# EasyEDA Pro project 学期项目.epro, board PCB1
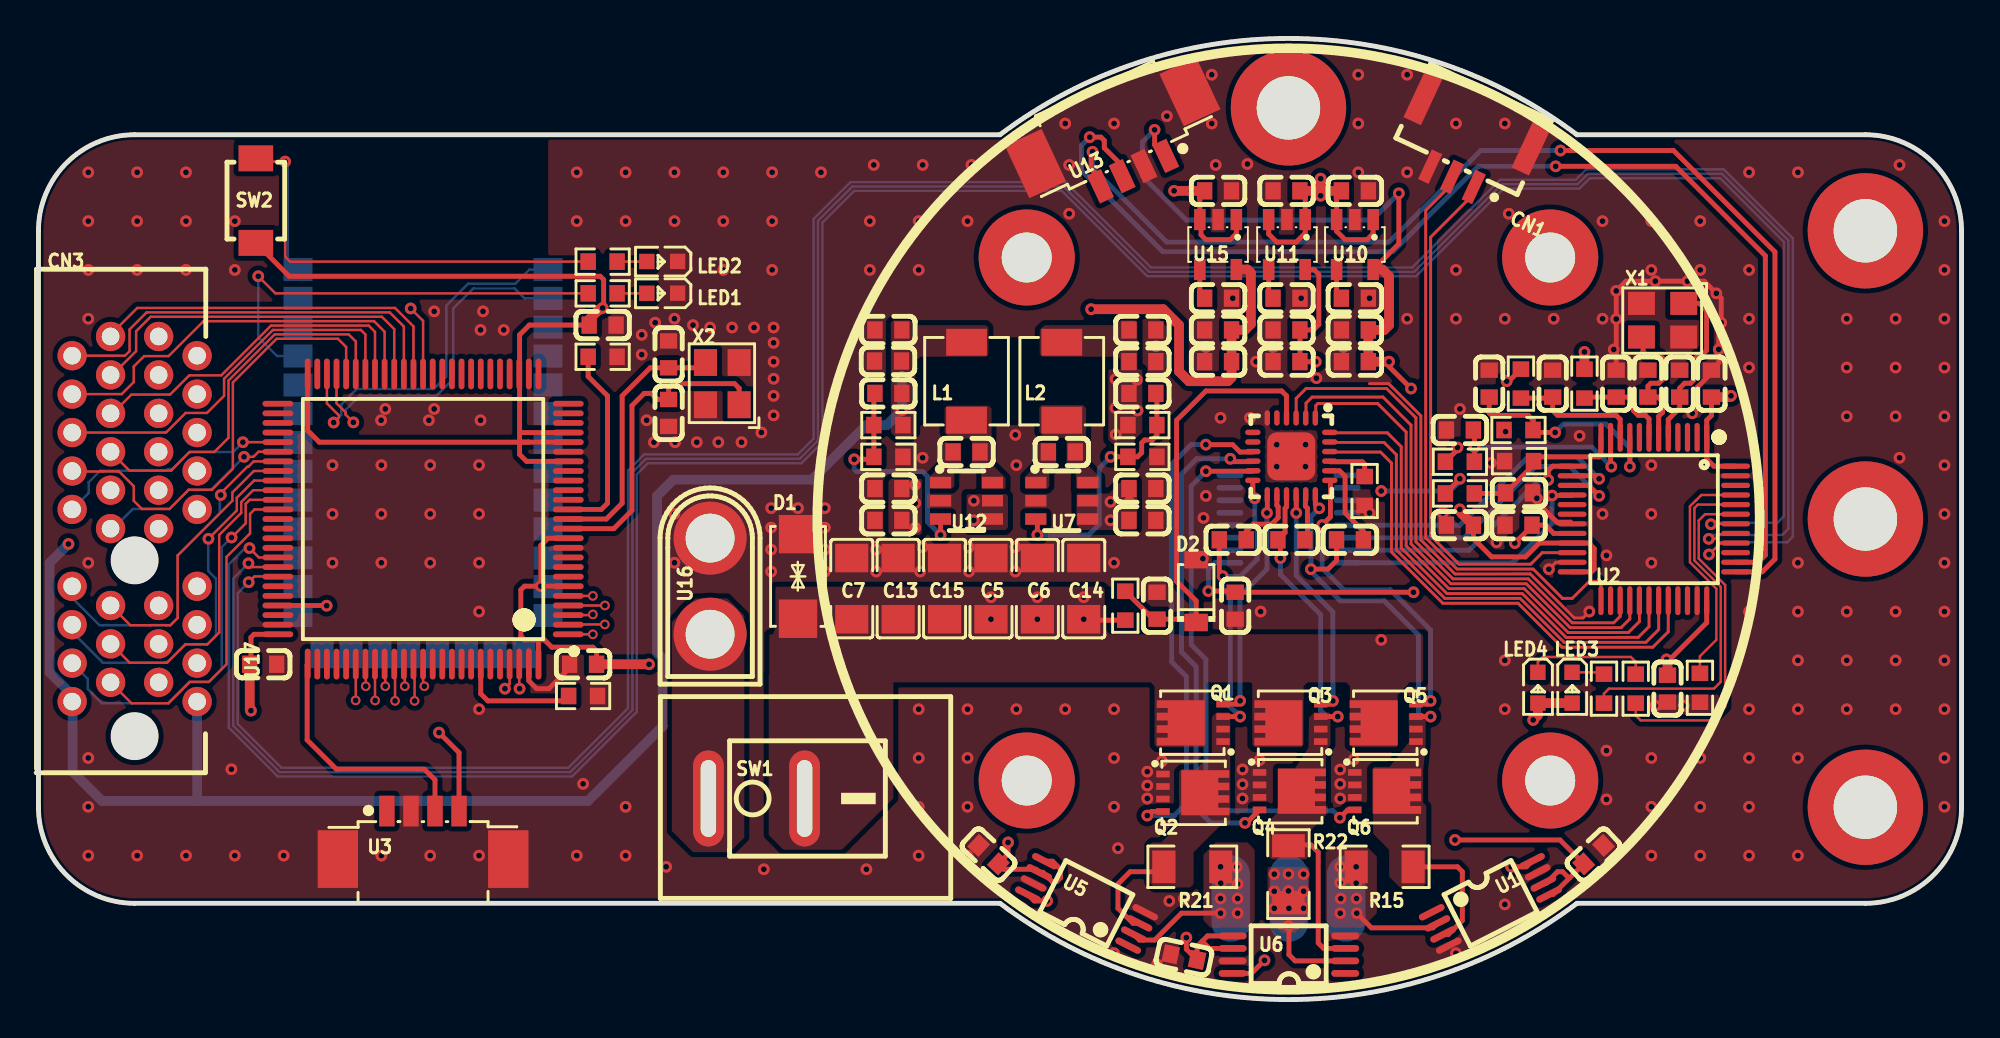
[diagram p11: board, top side]
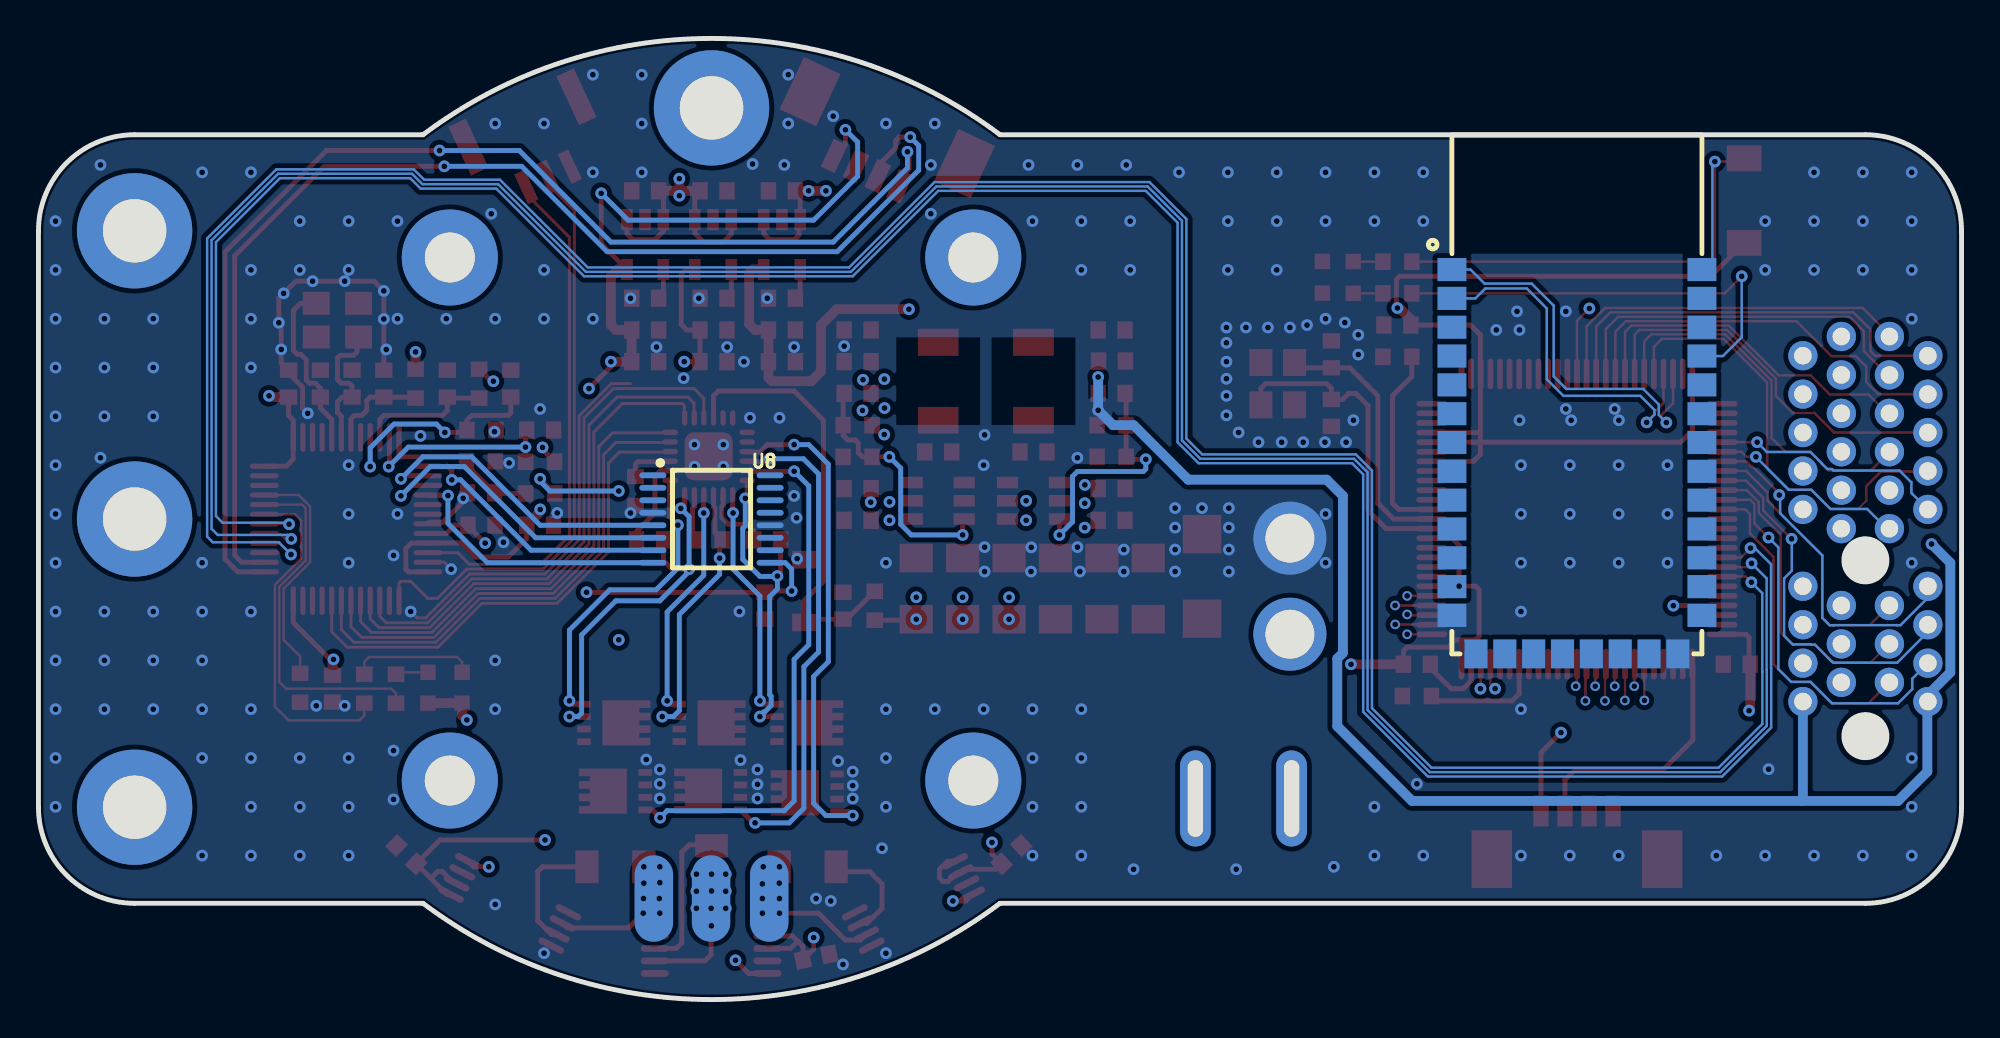
[diagram p12: board, bottom side, seen from below]

Outline 100 x 50.02 mm; copper layers: Top Layer, 地层, 电源层, Bottom Layer. Coordinates in mm from the lower left corner of the outline.
Outline path: 0,40.01 arc(1.46,43.54) 5,45.01 50,45.01 arc(65,50.02) 80,45.01 95,45.01 arc(98.54,43.54) 100,40.01 100,10.01 arc(98.54,6.47) 95,5.01 80,5.01 arc(65,0) 50,5.01 5,5.01 arc(1.46,6.47) 0,10.01 0,40.01
Stack: Top Layer 0.035mm Outer layer thickness 1oz / Dielectric1 0.2104mm 7628 RC49% 8.6mil / 地层 0.0152mm Inner layer thickness / Dielectric2 1.065mm 1.1mm H/HOZ Copper / 电源层 0.0152mm Inner layer thickness / Dielectric3 0.2104mm 7628 RC49% 8.6mil / Bottom Layer 0.035mm Outer layer thickness 1oz

## Design rules (mm)
spacing copperThickness1oz (default): track to track 0.102, other pairs 0.152 to 0.3
spacing copperThickness2oz: track to track 0.203, other pairs 0.152 to 0.3
spacing safeClearance1: track to track 0.152, other pairs 0.152 to 0.3
track width copperThickness1oz (default): min 0.127, default 0.254, max 2.54
track width copperThickness2oz: min 0.203, default 0.254, max 2.54
differential pair differentialPair (default): width min 0.127, default 0.254, max 2.54; gap min 0.152, default 0.152
net GND uses copperRegion

## Placement (name value [footprint] x y rotation side)
C1  10uF  [C0603]  58.17 20.5 270 top
C2  100nF  [C0603]  49.4 7.54 317 top
C3  100nF  [C0603]  80.87 7.54 223 top
C4  1uF  [C0603]  62.1 23.93 180 top
C5  47uF  [C1206]  49.53 21.39 270 top
C6  47uF  [C1206]  51.94 21.39 270 top
C7  47uF  [C1206]  42.29 21.39 270 top
C8  100nF  [C0603]  64.9 34.85 0 top
C9  100nF  [C0603]  64.9 33.2 0 top
C10  100nF  [C0603]  82.04 32.06 270 top
C11  10uF  [C0603]  57.4 34.85 180 top
C12  100nF  [C0603]  11.69 17.45 180 top
C13  47uF  [C1206]  44.7 21.39 270 top
C14  47uF  [C1206]  54.36 21.39 270 top
C15  47uF  [C1206]  47.12 21.39 270 top
C16  100nF  [C0603]  59.56 2.21 348 top
C17  100nF  [C0603]  68.45 33.2 0 top
C18  100nF  [C0603]  68.45 34.85 0 top
C19  100nF  [C0603]  68.45 36.5 180 top
C20  100nF  [C0603]  62.23 20.5 270 top
C21  100nF  [C0603]  76.99 26.37 180 top
C22  100nF  [C0603]  44.18 33.23 0 top
C23  100nF  [C0603]  73.91 29.64 0 top
C24  100nF  [C0603]  78.74 32.06 90 top
C25  100nF  [C0603]  64.9 36.5 180 top
C26  100nF  [C0603]  48.26 28.5 180 top
C27  22uF  [C0603]  57.4 24.94 180 top
C28  100nF  [C0603]  87 32.06 90 top
C29  100nF  [C0603]  84.71 16.18 270 top
C30  100nF  [C0603]  73.91 24.69 180 top
C31  16pF  [C0603]  83.69 32.06 270 top
C32  16pF  [C0603]  85.34 32.06 90 top
C33  100nF  [C0603]  57.4 33.2 180 top
C34  100nF  [C0603]  53.21 28.5 180 top
C35  100pF  [C0603]  57.4 31.55 180 top
C36  100nF  [C0603]  57.4 26.59 180 top
C37  1uF  [C0603]  68.45 42.09 180 top
C38  1uF  [C0603]  64.9 42.09 0 top
C39  100nF  [C0603]  76.96 24.69 0 top
C40  100nF  [C0603]  28.32 17.45 0 top
C41  100nF  [C0603]  75.44 32.06 90 top
C42  1uF  [C0603]  65.15 23.93 180 top
C43  1uF  [C0603]  68.2 23.93 180 top
C44  100pF  [C0603]  44.2 31.55 0 top
C45  100nF  [C0603]  44.2 24.94 0 top
C46  10uF  [C0603]  44.2 34.85 0 top
C47  100nF  [C0603]  29.34 35.1 180 top
C48  22uF  [C0603]  44.2 26.59 0 top
C49  16pF  [C0603]  32.77 33.58 270 top
C50  16pF  [C0603]  32.77 30.53 270 top
C51  100nF  [C0603]  61.34 33.2 0 top
C52  100nF  [C0603]  61.34 34.85 0 top
C53  100nF  [C0603]  61.34 36.5 180 top
C54  1uF  [C0603]  61.34 42.09 180 top
CN1  WAFER-GH1.25-3PWB  [CONN-TH_3P-P1.25_GH1.25]  74.17 44.25 155 top
CN3  3183-10110P1T  [CONN-TH_36P-P1.00-V_3183-XXXXXPXT]  5 25.01 270 top
D1  SMAJ40CA  [SMA_L4.3-W2.6-LS5.0-BI]  39.5 22.02 270 top
D2  MM1Z20  [SOD-123_L2.7-W1.6-LS3.7-RD]  60.2 21.26 90 top
L1  10uH  [IND-SMD_L4.4-W4.2]  48.26 32.18 270 top
L2  10uH  [IND-SMD_L4.4-W4.2]  53.21 32.18 270 top
LED1  -  [LED_0603]  32.38 36.75 180 top
LED2  -  [LED_0603]  32.38 38.41 180 top
LED3  -  [LED_0603]  79.76 16.18 270 top
LED4  -  [LED_0603]  77.98 16.18 270 top
NOREF  -  [Pad_e466]  51.39 11.4 0 top
NOREF#2  -  [Pad_e451]  95 40.01 0 top
NOREF#3  -  [Pad_e452]  95 25.01 0 top
NOREF#4  -  [Pad_e467]  78.61 11.4 0 top
NOREF#5  -  [Pad_e495]  65 46.41 0 top
NOREF#6  -  [Pad_e544]  68 5.26 0 top
NOREF#7  -  [Pad_e468]  78.61 38.62 0 top
NOREF#8  -  [Pad_e542]  62 5.26 0 top
NOREF#9  -  [Pad_e543]  65.02 5.26 0 top
NOREF#10  -  [Pad_e469]  51.39 38.62 0 top
NOREF#11  -  [Pad_e453]  95 10.01 0 top
Q1  AON7544  [DFN-8_L3.3-W3.3-P0.65-BL-2]  60.83 14.4 90 top
Q2  AON7544  [DFN-8_L3.3-W3.3-P0.65-BL-2]  59.24 10.76 270 top
Q3  AON7544  [DFN-8_L3.3-W3.3-P0.65-BL-2]  65.91 14.4 90 top
Q4  AON7544  [DFN-8_L3.3-W3.3-P0.65-BL-2]  64.26 10.85 270 top
Q5  AON7544  [DFN-8_L3.3-W3.3-P0.65-BL-2]  70.87 14.4 90 top
Q6  AON7544  [DFN-8_L3.3-W3.3-P0.65-BL-2]  69.22 10.85 270 top
R1  10K  [R0603]  80.39 32.06 90 top
R2  43K  [R0603]  44.2 29.9 0 top
R3  40K  [R0603]  68.96 26.47 270 top
R4  100R  [R0603]  77.09 32.06 90 top
R5  510  [R0603]  56.51 20.5 270 top
R6  10K  [R0603]  81.41 16.18 270 top
R7  10K  [R0603]  83.06 16.18 270 top
R8  75K  [R0603]  73.91 26.34 180 top
R9  10K  [R0603]  76.99 28.02 0 top
R10  10K  [R0603]  44.2 28.25 180 top
R12  10K  [R0603]  86.4 16.23 270 top
R13  100R  [R0603]  73.91 27.99 180 top
R14  100R  [R0603]  76.96 29.64 180 top
R15  20mΩ  [R1206]  70 6.91 180 top
R16  22K  [R0603]  57.4 29.9 180 top
R17  10K  [R0603]  28.32 15.8 0 top
R18  3K  [R0603]  57.4 28.25 180 top
R19  10K  [R0603]  29.34 33.45 0 top
R20  10K  [R0603]  29.34 36.75 180 top
R21  20mΩ  [R1206]  60 6.91 0 top
R22  20mΩ  [R1206]  65 6.53 270 top
R23  10K  [R0603]  29.34 38.41 180 top
SW1  HX KCD11-2P-R  [SW-TH_2P-L15.0-W10.5-P5.00_KCD11-2P-R]  37.34 10.47 0 top
SW2  K2-1807SN-A4DW-06  [SW-SMD_L4.0-W2.9-LS4.8-1]  11.3 41.58 270 top
U1  INA240A2QPWRQ1  [TSSOP-8_L4.4-W3.0-P0.65-LS6.4-BL]  75.5 5 297 top
U2  STM32G431CBT6  [LQFP-48_L7.0-W7.0-P0.50-LS9.0-BL]  84 25.01 180 top
U3  ZX-MX1.25-4PWT  [CONN-SMD_4P-P1.25-MX1.25-4P-WT]  20 8.56 0 top
U4  DRV8300D  [QFN24_L4.0_W4.0_P0.5]  65.15 28.27 180 top
U5  INA240A2QPWRQ1  [TSSOP-8_L4.4-W3.0-P0.65-LS6.4-BL]  54.5 5 63 top
U6  INA240A2QPWRQ1  [TSSOP-8_L4.4-W3.0-P0.65-LS6.4-BL]  65.02 2.34 90 top
U7  ME3121AM6G  [SOT-23-6_L2.9-W1.6-P0.95-LS2.8-BR]  53.21 25.96 180 top
U8  MT6826S  [TSSOP16_L5.0_W4.4_P0.65]  65 25.01 180 bottom
U10  RS3236-3.3AYF5  [SOT-23-5_L3.0-W1.7-P0.95-LS2.8-BR]  68.45 39.29 90 top
U11  RS3236-3.3AYF5  [SOT-23-5_L3.0-W1.7-P0.95-LS2.8-BR]  64.92 39.29 90 top
U12  ME3121AM6G  [SOT-23-6_L2.9-W1.6-P0.95-LS2.8-BR]  48.26 25.96 180 top
U13  ZX-MX1.25-4PWT  [CONN-SMD_4P-P1.25-MX1.25-4P-WT]  56.39 44.25 205 top
U14  HC05  [BULETM-SMD_HC-05]  20 27.99 180 bottom
U15  RS3236-3.3AYF5  [SOT-23-5_L3.0-W1.7-P0.95-LS2.8-BR]  61.34 39.29 90 top
U16  XT30U-M.G.B  [CONN-TH_XT30U-M]  34.93 21.51 90 top
U17  STM32F407VET6  [LQFP-100_L14.0-W14.0-P0.50-LS16.0-BL]  20 25.01 90 top
X1  16MHz  [OSC-SMD_4P-L3.2-W2.5-BL]  84.46 35.36 180 top
X2  16MHz  [OSC-SMD_4P-L3.2-W2.5-BL]  35.56 32.06 90 top

## Footprints (pads in the part's own frame, mm; a bottom-side part is the same pattern mirrored in y, then rotated)
BULETM-SMD_HC-05
  rect 1.5x1.2 smd: 1(-6.5,10) 2(-6.5,8.5) 3(-6.5,7) 4(-6.5,5.5) 5(-6.5,4) 6(-6.5,2.5) 7(-6.5,1) 8(-6.5,-0.5) 9(-6.5,-2) 10(-6.5,-3.5) 11(-6.5,-5) 12(-6.5,-6.5) 13(-6.5,-8) 22(6.5,-8) 23(6.5,-6.5) 24(6.5,-5) 25(6.5,-3.5) 26(6.5,-2) 27(6.5,-0.5) 28(6.5,1) 29(6.5,2.5) 30(6.5,4) 31(6.5,5.5) 32(6.5,7) 33(6.5,8.5) 34(6.5,10)
  rect 1.2x1.5 smd: 14(-5.25,-10) 15(-3.75,-10) 16(-2.25,-10) 17(-0.75,-10) 18(0.75,-10) 19(2.25,-10) 20(3.75,-10) 21(5.25,-10)
C0603
  rect 0.8x0.9 smd: 1(-0.7,0) 2(0.7,0)
C1206
  rect 1.485x1.728 smd: 1(-1.593,0) 2(1.593,0)
CONN-SMD_4P-P1.25-MX1.25-4P-WT
  rect 0.8x1.6 smd: 1(-1.88,1.25) 2(-0.63,1.25) 3(0.62,1.25) 4(1.87,1.25)
  rect 2.1x3 smd: 5(4.43,-1.25) 6(-4.43,-1.25)
CONN-TH_3P-P1.25_GH1.25
  rect 0.6x1.7 smd: 1(-1.25,1.575) 2(0,1.575) 3(1.25,1.575)
  rect 1x2.8 smd: 4(3.1,-1.575) 5(-3.1,-1.575)
CONN-TH_36P-P1.00-V_3183-XXXXXPXT
  round 1.524 hole 0.914: A1(-9.5,1.25) A2(-8.5,3.25) A3(-7.5,1.25) A4(-6.5,3.25) A5(-5.5,1.25) A6(-4.5,3.25) A7(-3.5,1.25) A8(-2.5,3.25) A9(-1.5,1.25) A10(-0.5,3.25) A11(0.5,1.25) A12(3.5,3.25) A13(4.5,1.25) A14(5.5,3.25) A15(6.5,1.25) A16(7.5,3.25) A17(8.5,1.25) A18(9.5,3.25) B1(-9.5,-1.25) B2(-8.5,-3.25) B3(-7.5,-1.25) B4(-6.5,-3.25) B5(-5.5,-1.25) B6(-4.5,-3.25) B7(-3.5,-1.25) B8(-2.5,-3.25) B9(-1.5,-1.25) B10(-0.5,-3.25) B11(0.5,-1.25) B12(3.5,-3.25) B13(4.5,-1.25) B14(5.5,-3.25) B15(6.5,-1.25) B16(7.5,-3.25) B17(8.5,-1.25) B18(9.5,-3.25)
CONN-TH_XT30U-M
  round 3.8 hole 2.54: 1(-2.5,0) 2(2.5,0)
DFN-8_L3.3-W3.3-P0.65-BL-2
  rect 0.35x0.7 smd: 1(-0.975,-0.765) 2(-0.325,-0.765) 3(0.325,-0.765) 4(0.975,-0.765)
  custom 2.352x2.498 smd: 5(0,0.765)
IND-SMD_L4.4-W4.2
  rect 1.4x2.12 smd: 1(2.028,0) 2(-2.028,0)
LED_0603
  rect 0.8x0.8 smd: 1(-0.851,-0.01) 2(0.75,-0.005)
LQFP-48_L7.0-W7.0-P0.50-LS9.0-BL
  oval 0.27x1.5 smd: 1(-2.75,-4.25) 2(-2.25,-4.25) 3(-1.75,-4.25) 4(-1.25,-4.25) 5(-0.75,-4.25) 6(-0.25,-4.25) 7(0.25,-4.25) 8(0.75,-4.25) 9(1.25,-4.25) 10(1.75,-4.25) 11(2.25,-4.25) 12(2.75,-4.25) 25(2.75,4.25) 26(2.25,4.25) 27(1.75,4.25) 28(1.25,4.25) 29(0.75,4.25) 30(0.25,4.25) 31(-0.25,4.25) 32(-0.75,4.25) 33(-1.25,4.25) 34(-1.75,4.25) 35(-2.25,4.25) 36(-2.75,4.25)
  oval 1.5x0.27 smd: 13(4.25,-2.75) 14(4.25,-2.25) 15(4.25,-1.75) 16(4.25,-1.25) 17(4.25,-0.75) 18(4.25,-0.25) 19(4.25,0.25) 20(4.25,0.75) 21(4.25,1.25) 22(4.25,1.75) 23(4.25,2.25) 24(4.25,2.75) 37(-4.25,2.75) 38(-4.25,2.25) 39(-4.25,1.75) 40(-4.25,1.25) 41(-4.25,0.75) 42(-4.25,0.25) 43(-4.25,-0.25) 44(-4.25,-0.75) 45(-4.25,-1.25) 46(-4.25,-1.75) 47(-4.25,-2.25) 48(-4.25,-2.75)
LQFP-100_L14.0-W14.0-P0.50-LS16.0-BL
  oval 0.3x1.6 smd: 1(-6,-7.55) 2(-5.5,-7.55) 3(-5,-7.55) 4(-4.5,-7.55) 5(-4,-7.55) 6(-3.5,-7.55) 7(-3,-7.55) 8(-2.5,-7.55) 9(-2,-7.55) 10(-1.5,-7.55) 11(-1,-7.55) 12(-0.5,-7.55) 13(0,-7.55) 14(0.5,-7.55) 15(1,-7.55) 16(1.5,-7.55) 17(2,-7.55) 18(2.5,-7.55) 19(3,-7.55) 20(3.5,-7.55) 21(4,-7.55) 22(4.5,-7.55) 23(5,-7.55) 24(5.5,-7.55) 25(6,-7.55) 51(6,7.55) 52(5.5,7.55) 53(5,7.55) 54(4.5,7.55) 55(4,7.55) 56(3.5,7.55) 57(3,7.55) 58(2.5,7.55) 59(2,7.55) 60(1.5,7.55) 61(1,7.55) 62(0.5,7.55) 63(0,7.55) 64(-0.5,7.55) 65(-1,7.55) 66(-1.5,7.55) 67(-2,7.55) 68(-2.5,7.55) 69(-3,7.55) 70(-3.5,7.55) 71(-4,7.55) 72(-4.5,7.55) 73(-5,7.55) 74(-5.5,7.55) 75(-6,7.55)
  oval 1.6x0.3 smd: 26(7.55,-6) 27(7.55,-5.5) 28(7.55,-5) 29(7.55,-4.5) 30(7.55,-4) 31(7.55,-3.5) 32(7.55,-3) 33(7.55,-2.5) 34(7.55,-2) 35(7.55,-1.5) 36(7.55,-1) 37(7.55,-0.5) 38(7.55,0) 39(7.55,0.5) 40(7.55,1) 41(7.55,1.5) 42(7.55,2) 43(7.55,2.5) 44(7.55,3) 45(7.55,3.5) 46(7.55,4) 47(7.55,4.5) 48(7.55,5) 49(7.55,5.5) 50(7.55,6) 76(-7.55,6) 77(-7.55,5.5) 78(-7.55,5) 79(-7.55,4.5) 80(-7.55,4) 81(-7.55,3.5) 82(-7.55,3) 83(-7.55,2.5) 84(-7.55,2) 85(-7.55,1.5) 86(-7.55,1) 87(-7.55,0.5) 88(-7.55,0) 89(-7.55,-0.5) 90(-7.55,-1) 91(-7.55,-1.5) 92(-7.55,-2) 93(-7.55,-2.5) 94(-7.55,-3) 95(-7.55,-3.5) 96(-7.55,-4) 97(-7.55,-4.5) 98(-7.55,-5) 99(-7.55,-5.5) 100(-7.55,-6)
OSC-SMD_4P-L3.2-W2.5-BL
  rect 1.4x1.2 smd: 1(-1.1,-0.875) 2(1.1,-0.875) 3(1.1,0.875) 4(-1.1,0.875)
Pad_e451
  round 6 hole 3.3: 1(0,0)
Pad_e452
  round 6 hole 3.3: 1(0,0)
Pad_e453
  round 6 hole 3.3: 1(0,0)
Pad_e466
  round 5 hole 2.6: 1(0,0)
Pad_e467
  round 5 hole 2.6: 1(0,0)
Pad_e468
  round 5 hole 2.6: 1(0,0)
Pad_e469
  round 5 hole 2.6: 1(0,0)
Pad_e495
  round 6 hole 3.3: 1(0,0)
Pad_e542
  oval 2x4.5 smd far side: 6(0,0)
Pad_e543
  oval 2x4.5 smd far side: 6(0,0)
Pad_e544
  oval 2x4.5 smd far side: 6(0,0)
QFN24_L4.0_W4.0_P0.5
  rrect 0.28x0.8 smd: 1(-1.25,-2) 2(-0.75,-2) 3(-0.25,-2) 4(0.25,-2) 5(0.75,-2) 6(1.25,-2) 13(1.25,2) 14(0.75,2) 15(0.25,2) 16(-0.25,2) 17(-0.75,2) 18(-1.25,2)
  rrect 0.8x0.28 smd: 7(2,-1.25) 8(2,-0.75) 9(2,-0.25) 10(2,0.25) 11(2,0.75) 12(2,1.25) 19(-2,1.25) 20(-2,0.75) 21(-2,0.25) 22(-2,-0.25) 23(-2,-0.75) 24(-2,-1.25)
  rrect 2.5x2.5 smd: 25(0,0)
R0603
  rect 0.806x0.864 smd: 1(-0.753,0) 2(0.753,0)
R1206
  rect 1.208x1.701 smd: 1(-1.479,0) 2(1.479,0)
SMA_L4.3-W2.6-LS5.0-BI
  rect 2x2 smd: 1(-2.2,0) 2(2.2,0)
SOD-123_L2.7-W1.6-LS3.7-RD
  rect 0.91x1.22 smd: 1(-1.635,0) 2(1.635,0)
SOT-23-5_L3.0-W1.7-P0.95-LS2.8-BR
  rect 1.1x0.6 smd: 1(1.3,-0.95) 2(1.3,0) 3(1.3,0.95) 4(-1.3,0.95) 5(-1.3,-0.95)
SOT-23-6_L2.9-W1.6-P0.95-LS2.8-BR
  rect 1.1x0.6 smd: 1(1.35,-0.95) 2(1.35,0) 3(1.35,0.95) 4(-1.35,0.95) 5(-1.35,0) 6(-1.35,-0.95)
SW-SMD_L4.0-W2.9-LS4.8-1
  rect 1.35x1.8 smd: 1(-2.2,0) 2(2.2,0)
SW-TH_2P-L15.0-W10.5-P5.00_KCD11-2P-R
  oval 1.6x5 hole 0.8x4: 1(-2.5,0) 2(2.5,0)
TSSOP16_L5.0_W4.4_P0.65
  oval 1.4x0.3 smd: 1(-3.054,2.275) 2(-3.054,1.625) 3(-3.054,0.975) 4(-3.054,0.325) 5(-3.054,-0.325) 6(-3.054,-0.975) 7(-3.054,-1.625) 8(-3.054,-2.275) 9(3.046,-2.275) 10(3.046,-1.625) 11(3.046,-0.975) 12(3.046,-0.325) 13(3.046,0.325) 14(3.046,0.975) 15(3.046,1.625) 16(3.046,2.275)
TSSOP-8_L4.4-W3.0-P0.65-LS6.4-BL
  oval 0.353x1.454 smd: 1(-0.975,-2.927) 2(-0.325,-2.927) 3(0.325,-2.927) 4(0.975,-2.927) 5(0.975,2.927) 6(0.325,2.927) 7(-0.325,2.927) 8(-0.975,2.927)

## Nets
As in the schematic, except:
MOTOR_U: NOREF#6.6 R15.2 U1.2
MOTOR_V: NOREF#9.6 R22.2 U6.2
MOTOR_W: NOREF#8.6 R21.2 U5.2

Pads without a net: NOREF 1; NOREF#2 1; NOREF#3 1; NOREF#4 1; NOREF#5 1; NOREF#7 1; NOREF#10 1; NOREF#11 1; U1 1; U2 2 3 4 8 17 18 26 39 46; U4 5 7 8; U5 1; U6 1; U8 1 2 3 10 11 13 14 15 16; U14 3 4 5 6 7 8 9 10 11 14 15 16 17 18 19 20 22 23 24 25 26 27 28 29 30 32 33; U17 7 8 9 15 16 17 18 23 24 25 26 29 30 31 32 33 34 35 36 37 49 51 52 53 54 63 64 65 66 70 71 73 77 78 79 80 89 90 91 92 93 95 96

## Via types
v1: diameter 0.61, hole 0.305, Top Layer to Bottom Layer, 414 vias
v2: diameter 0.5, hole 0.3, Top Layer to Bottom Layer, 8 vias
v3: diameter 0.5, hole 0.305, Top Layer to Bottom Layer, 5 vias

## Routing (per net, layer and track width the routed paths; a pad name or vN(x,y) marks a point on that pad's centre or on a via; arc(x,y) is an arc through that point)
+5V: length 20.2
  Top Layer w0.254: C37.2 67.5,41.84 U10.3 67.5,39.99 67.94,39.55 69.09,39.55 69.4,39.86 U10.1 ; U15.1 62.29,39.86 61.98,39.55 60.71,39.55 60.45,39.8 60.45,40.53 U15.3 60.39,41.84 60.64,42.09 ; C38.2 65.87,41.81 65.87,39.89 65.41,39.42 64.39,39.42 63.97,39.84 U11.3
  Top Layer w0.508: v1(66.68,42.72) v1(66.68,41.83) 66.42,42.09 C38.2 ; 66.93,42.09 C37.2 ; v1(59.05,42.09) v1(59.95,42.09) 60.64,42.09
  vias: v1(56.01,32.29) v1(56.01,30.79) v1(56.02,29.41) v1(57.12,32.26) v1(57.15,30.66)
AVCC: length 98.3
  Top Layer w0.254: U5.5 52.73,7.2 53.15,6.78 53.15,6.34 52.96,6.15 52.71,6.15 52.23,6.62 U5.6 51.88,6.78 50.2,6.78 49.91,7.07 50.42,7.57 v1(50.42,8.18) ; 60.51,3.03 60.52,3.03 60.89,2.66 U6.6 ; 60.51,3.03 60.79,3.31 U6.5 ; 60.51,3.03 60.25,2.77 C16.2 59.69,2.62 v1(59.69,3.23) ; U1.5 78.75,5.46 79.63,6.34 ; U1.6 78.38,6.04 78.99,6.66 79.25,6.66 79.56,6.34 79.63,6.34 ; 79.63,6.34 80.35,7.07 80.35,7.07 79.12,8.31 v1(73.66,8.31) ; v1(66.42,33.2) C9.2 C8.2 66.29,34.85 66.58,35.13 66.58,37.74 66.32,37.99 65.87,37.99 ; U2.20 78.79,24.26 78.36,24.69 C39.2 77.66,24.65 v1(76.77,23.76)
  电源层 w0.254: 72.14,24.55 72.14,32.06 71.75,32.44 67.18,32.44 v1(66.42,33.2) ; 72.14,24.55 72.15,24.54 75.99,24.54 v1(76.77,23.76) ; 72.14,24.55 72.14,20.37 73.66,18.85 v1(73.66,8.31) 73.66,7.31 69.04,2.68 60.23,2.68 v1(59.69,3.23) 54.74,8.18 v1(50.42,8.18)
GND: length 45.2
  Top Layer w0.152: v1(78.54,22.4) 78.9,22.76 U2.23 ; 69.22,32.06 70.21,32.06 71.88,30.38 71.88,23.93 73.66,22.15 77.57,22.15 79.86,19.86 80.31,19.86 v1(80.65,20.19)
  Top Layer w0.254: C40.1 27.62,17.26 26.54,16.18 25.91,16.18 25.5,16.59 U17.99 ; v1(86,30.51) 86.27,30.78 86.27,31.87 87,32.6 C28.2 87.38,33.14 v1(87.38,33.84) 87.38,35.1 v1(87.5,35.22) 87.5,36.5 v1(87.25,36.75) 86.61,37.39 v1(85.74,37.39) v1(84.08,37.39) 82.55,37.39 v1(82.04,36.88) v1(82.04,35.42) C10.1 ; U2.19 79.66,24.85 78.96,24.85 77.92,25.89 v1(77.92,26.09) 77.92,26.14 C21.1
  vias: v1(2.59,43.05) v1(2.59,40.51) v1(2.59,37.97) v1(2.59,35.43) v1(2.59,22.73) v1(2.59,12.57) v1(2.59,10.03) v1(2.59,7.49) v1(5.13,43.05) v1(5.13,40.51) v1(5.13,37.97) v1(5.13,7.49) v1(7.67,43.05) v1(7.67,40.51) v1(7.67,37.97) v1(7.67,7.49) v1(10.03,11.99) v1(10.21,40.51) v1(10.21,37.97) v1(10.21,7.49) v1(12.75,7.49) v1(15.29,27.81) v1(15.29,25.27) v1(15.29,22.73) v1(17.82,30.15) v1(17.83,27.81) v1(17.83,25.27) v1(17.83,22.73) v1(17.83,7.49) v1(18.04,30.74) v1(20.3,30.15) v1(20.37,27.81) v1(20.37,25.27) v1(20.37,22.73) v1(20.37,7.49) v1(20.58,35.82) v1(20.58,30.74) v1(22.91,27.81) v1(22.91,25.27) v1(22.91,22.73) v1(22.91,20.19) v1(22.91,15.11) v1(22.91,7.49) v1(22.99,34.85) v1(22.99,30.15) v1(23.12,35.82) v1(24.19,34.85) v1(27.99,43.05) v1(27.99,40.51) v1(27.99,7.49) v1(28.32,11.23) v1(30.53,43.05) v1(30.53,40.51) v1(30.53,10.03) v1(30.53,7.49) v1(31.37,34.6) v1(31.37,33.57) v1(31.62,30.15) v1(32,29.01) v1(32.07,35.23) v1(32.64,6.91) v1(33.07,43.05) v1(33.07,40.51) v1(33.07,35.43) v1(33.1,29.01) v1(33.07,25.27) v1(33.07,22.73) v1(34.04,35.1) v1(34.23,29.01) v1(34.93,34.98) v1(35.35,29.01) v1(35.61,43.05) v1(35.61,40.51) v1(35.61,37.97) v1(36.07,34.98) v1(36.56,29.01) v1(37.21,34.98) v1(37.59,29.52) v1(37.72,6.78) v1(38.1,25.58) v1(38.1,24.56) v1(38.1,23.42) v1(38.1,22.28) v1(38.15,43.05) v1(38.15,40.51) v1(38.15,37.97) v1(38.23,34.98) v1(38.23,34.18) v1(38.23,33.2) v1(38.23,32.31) v1(38.23,31.42) v1(38.23,30.4) v1(39.5,25.58) v1(40.69,43.05) v1(40.89,25.58) v1(40.89,24.56) v1(40.89,23.42) v1(40.89,22.28) v1(43.05,6.78) v1(43.23,40.51) v1(43.23,37.97) v1(43.44,43.44) v1(43.56,23.42) v1(43.56,22.28) v1(45.77,40.51) v1(45.77,37.97) v1(45.85,22.28) v1(45.77,15.11) v1(45.77,12.57) v1(45.77,10.03) v1(45.77,7.49) v1(45.98,43.44) v1(45.98,28.2) v1(45.97,23.55) v1(48.31,40.51) v1(48.31,15.11) v1(48.31,12.57) v1(48.31,10.03) v1(48.31,7.49) v1(48.38,23.54) v1(48.39,22.28) v1(48.52,43.44) v1(50.8,29.39) v1(50.8,23.55) v1(50.8,22.28) v1(50.85,27.81) v1(50.85,15.11) v1(53.39,45.59) v1(53.39,15.11) v1(53.6,43.44) v1(53.6,40.9) v1(55.93,45.59) v1(55.93,22.73) v1(55.93,15.11) v1(55.93,12.57) v1(55.93,10.03) v1(55.93,2.41) v1(56.14,7.88) v1(57.66,11.86) v1(57.66,11.14) v1(57.66,10.47) v1(58.1,34.01) v1(58.17,1.83) v1(58.42,12.41) v1(58.68,45.98) v1(58.8,5.13) v1(59.56,5.26) v1(60.58,25.07) v1(60.55,22.95) v1(60.71,33.96) v1(60.71,26.21) v1(61.01,48.13) v1(61.01,45.59) v1(61.22,43.44) v1(61.47,30.28) v1(62.1,36.5) v1(62.61,11.98) v1(62.61,11.2) v1(62.61,10.47) v1(62.87,43.49) v1(63,30.28) v1(63.32,33.2) v1(63.49,12.46) v1(63.55,20.19) v1(64.19,33.96) v1(64.39,28.88) v1(64.39,27.74) v1(65.66,36.5) v1(65.89,28.88) v1(65.88,27.74) v1(66.45,32.34) v1(67.69,11.97) v1(67.69,11.22) v1(67.69,10.47) v1(67.86,33.96) v1(68.4,12.49) v1(68.63,48.13) v1(68.63,45.59) v1(68.63,43.05) v1(69.22,36.5) v1(69.22,25.32) v1(71.17,48.13) v1(71.17,43.05) v1(71.17,35.43) v1(73.03,25.32) v1(73.71,45.59) v1(73.71,37.97) v1(73.71,35.43) v1(73.71,2.41) v1(73.92,30.74) v1(75.53,27.93) v1(75.82,23.8) v1(76.25,45.59) v1(76.25,35.43) v1(76.25,17.65) v1(76.25,15.11) v1(76.25,4.95) v1(76.46,40.9) v1(78.79,35.43) v1(80.14,29.34) v1(81.33,40.51) v1(81.33,35.43) v1(81.33,25.27) v1(81.54,23.12) v1(81.54,12.96) v1(81.54,10.42) v1(81.91,33.83) v1(83.87,40.51) v1(83.87,37.97) v1(83.87,27.81) v1(83.87,25.27) v1(83.87,22.73) v1(83.87,12.57) v1(83.87,10.03) v1(83.87,7.49) v1(84.07,15.29) v1(85.56,15.29) v1(86.41,40.51) v1(86.41,37.97) v1(86.41,12.57) v1(86.41,10.03) v1(86.41,7.49) v1(88.95,43.05) v1(88.95,37.97) v1(88.95,35.43) v1(88.95,32.89) v1(88.95,20.19) v1(88.95,15.11) v1(88.95,12.57) v1(88.95,10.03) v1(88.95,7.49) v1(91.49,43.05) v1(91.49,22.73) v1(91.49,20.19) v1(91.49,17.65) v1(91.49,15.11) v1(91.49,12.57) v1(91.49,7.49) v1(94.03,35.43) v1(94.03,32.89) v1(94.03,30.35) v1(94.03,20.19) v1(94.03,17.65) v1(94.03,15.11) v1(96.57,35.43) v1(96.57,32.89) v1(96.57,30.35) v1(96.57,20.19) v1(96.57,17.65) v1(96.57,15.11) v1(96.78,43.44) v1(96.78,28.2) v1(99.11,40.51) v1(99.11,37.97) v1(99.11,35.43) v1(99.11,32.89) v1(99.11,30.35) v1(99.11,27.81) v1(99.11,25.27) v1(99.11,22.73) v1(99.11,20.19) v1(99.11,17.65) v1(99.11,15.11) v1(99.11,12.57) v1(99.11,10.03)
PVCC: length 15.4
  Top Layer w0.254: R8.2 73.91,27.09 v1(73.91,27.1) ; R5.2 54.41,19.74 v1(54.36,19.79)
  电源层 w0.254: v1(69.82,26.47) v1(69.82,18.72)
  Bottom Layer w0.254: v1(73.91,27.1) 73.91,26.98 73.41,26.47 v1(69.82,26.47)
  vias: v1(45.59,26.79) v1(45.59,25.83) v1(45.59,24.56) v1(48.64,25.96) v1(48.64,24.94) v1(49.53,20.94) v1(49.53,19.79) v1(51.94,20.94) v1(51.94,19.79) v1(54.36,20.94) v1(55.75,25.9) v1(55.75,24.94) v1(56.72,25.88)
VCC: length 137.3
  Top Layer w0.254: v1(60.83,21.26) 62.17,21.26 C20.1 v1(71.5,21.2) ; U2.36 86.75,19.62 84.96,17.83 ; C28.1 87,30.4 86.75,30.15 U2.1 86.76,29.25 86.76,28.12 87.12,27.76 U2.48 ; C30.1 74.61,23.99 75.56,23.04 77.32,23.04 78.04,23.76 U2.21 80.61,23.76 80.9,23.47 80.9,22.4 80.75,22.26 U2.24 ; v1(70.74,41.96) 70.74,39.33 U10.5 ; v1(58.04,45.26) 58.04,44.49 U13.1 ; v1(71.37,31.8) 70.23,32.94 v1(70.23,33.2)
  Top Layer w0.508: U10.5 69.88,37.99 70.23,37.64 70.23,35.1 69.98,34.85 C18.2 C17.2 v1(70.23,33.2) ; C29.1 84.71,17.65 ; v1(88.01,31.42) 87.95,31.36 C28.1 ; C30.1 74.02,25.28 74.02,25.31 73.91,25.42 v1(73.91,25.51) ; R1.2 v1(80.39,33.71) ; LED3.2 LED4.2 77.97,14.8 v1(77.72,14.55)
  电源层 w0.254: v1(71.37,31.8) 71.63,31.55 71.63,21.33 v1(71.5,21.2)
  电源层 w0.508: v1(73.91,25.51) 72.99,26.43 72.99,33.2 ; 72.99,33.2 79.88,33.2 v1(80.39,33.71) 82.68,31.42 v1(88.01,31.42) 89.79,29.64 89.79,18.72 88.77,17.7 v1(84.66,17.7) 81.79,17.7 80.65,16.56 80.65,14.91 80.29,14.55 v1(77.72,14.55) ; 72.99,33.2 v1(70.23,33.2)
  Bottom Layer w0.254: U8.9 61.16,22.73 60.83,22.4 v1(60.83,21.26) ; v1(70.74,41.96) 69.34,40.56 59.69,40.56 57.4,42.85 57.4,44.63 v1(58.04,45.26)
CONNECT: length 144.9
  Top Layer w0.127: U17.67 11.46,23.01 v1(10.97,23.5) ; U2.42 86.99,24.76 v1(86.97,24.74)
  Bottom Layer w0.127: v1(10.97,23.5) 10.74,23.5 9.91,22.66 9.91,17.25 9.9,17.25 9.9,14.16 12.45,11.61 27.75,11.61 31.12,14.97 31.12,27.34 31.69,27.91 39.67,27.91 40.77,29.01 40.77,40.44 42.42,42.09 53.21,42.09 57.66,37.64 71.63,37.64 76.19,42.21 80.13,42.21 80.67,42.75 87.44,42.75 90.77,39.42 90.77,25.16 90.42,24.82 87.05,24.82 v1(86.97,24.74)
HC05_RX: length 19.2
  Top Layer w0.127: v1(16.37,30.04) 15.97,30.44 15.97,30.56 15.5,31.03 U17.47
  Bottom Layer w0.127: U14.2 25.28,36.49 24.76,37.01 22.61,37.01 21.57,35.97 21.57,32.29 20.7,31.42 16.7,31.42 15.97,30.69 15.97,30.44 v1(16.37,30.04)
HC05_TX: length 19.8
  Top Layer w0.127: v1(15.35,30.03) 15.38,30.03 15.62,30.28 15.62,30.4 15,31.03 U17.48
  Bottom Layer w0.127: v1(15.35,30.03) 15.74,30.42 15.74,30.97 16.55,31.78 20.55,31.78 21.21,32.44 21.21,36.12 22.35,37.26 24.8,37.26 25.53,37.99 U14.1
HIN1: length 26.5
  Top Layer w0.152: U2.32 84.75,19.14 83.94,18.34 79.23,18.34 76.94,20.62 73.03,20.63 70.36,23.29 70.36,27.93 69.79,28.5 67.15,28.5
HIN2: length 26.1
  Top Layer w0.152: 67.15,29 69.97,29 70.61,28.35 70.61,23.4 73.13,20.88 77.05,20.88 79.33,18.59 83.59,18.59 84.25,19.26 U2.31
HIN3: length 25.7
  Top Layer w0.152: U2.30 83.75,19.41 83.19,18.85 79.44,18.85 77.15,21.13 73.24,21.13 70.87,23.5 70.87,28.77 70.14,29.5 67.15,29.5
I_SENSE_U: length 25.9
  Top Layer w0.254: R15.1 73.79,6.91 74.04,6.66 74.04,4.12 73.31,3.39 U1.3 ; Q5.3 v1(72.39,14.73) ; U4.18 66.4,25.77 v1(66.6,25.57) ; C43.2 67.5,22.85 67.06,22.4 v1(66.17,22.4)
  Bottom Layer w0.254: v1(72.39,14.73) 71.94,14.73 71.75,14.91 71.75,18.97 69.98,20.75 67.69,20.75 66.17,22.28 66.17,25.13 v1(66.6,25.57)
I_SENSE_V: length 22.2
  Top Layer w0.254: Q3.3 v1(67.56,14.73) ; v1(64.58,22.97) 64.58,23.8 64.45,23.93 ; U4.15 64.9,25.64 64.82,25.57 64.82,24.3 C42.2 ; R22.1 65.04,8.05 66.17,8.05 66.55,7.67 66.55,2.94 66.83,2.66 U6.3
  Bottom Layer w0.254: v1(64.58,22.97) 64.58,22.13 66.68,20.03 66.68,15.04 66.99,14.73 v1(67.56,14.73)
I_SENSE_W: length 22.5
  Top Layer w0.254: U5.3 56.92,3.97 56.13,4.75 56.13,6.02 56.77,6.66 58.27,6.66 R21.1 ; U4.12 63.15,26.18 v1(63.25,26.09) ; v1(61.58,22.04) 61.4,22.21 C4.2 ; Q1.3 v1(62.48,14.73)
  Bottom Layer w0.254: v1(63.25,26.09) 63.25,24.65 63.37,24.53 63.37,22.91 62.48,22.02 61.59,22.02 ; v1(62.48,14.73) 62.48,14.78 62.3,14.96 62.24,14.96 61.9,15.3 61.9,15.79 61.98,15.86 61.98,20.97 61.58,21.37 v1(61.58,22.04)
I_U: length 52
  Top Layer w0.254: v1(52.45,5.13) 51.78,5.13 51.45,5.46
  电源层 w0.254: v1(76.29,29.56) 76.58,29.26 76.58,25.79 78.13,24.24 78.13,23.57 77.07,22.51 77.07,21.07 74.8,18.8 74.8,6.98 69.28,1.45 59.69,1.45 56.01,5.13 v1(52.45,5.13)
I_V: length 40.2
  Top Layer w0.254: R13.2 73.79,28.62 v1(73.79,28.74) ; v1(63.75,2.04) 63.07,1.36 U6.8
  电源层 w0.254: 73.87,28.74 v1(73.79,28.74) ; 73.87,28.74 76.07,26.53 76.07,25.58 77.62,24.03 77.62,23.78 76.56,22.72 76.56,21.28 74.29,19.01 74.29,7.16 69.22,2.08 63.79,2.08 v1(63.75,2.04) ; 73.87,28.74 73.93,28.74
I_W: length 31
  Top Layer w0.254: v1(76.58,6.91) 77.37,6.91 U1.8 ; v1(76.34,32.18) 76.46,32.18 R4.2
  电源层 w0.254: v1(76.34,32.18) 77.09,31.44 77.09,26 78.63,24.45 78.63,23.36 77.58,22.3 77.58,20.86 75.31,18.59 75.31,7.04 75.44,6.91 v1(76.58,6.91)
LED_G: length 18.7
  Top Layer w0.127: U2.44 86.29,25.76 86.11,25.58 86.11,22.85 87.48,21.48 87.48,16.54 87.12,16.18 81.66,16.18 81.41,15.93 R6.2
LED_R: length 18
  Top Layer w0.127: U2.43 86.66,25.26 86.34,24.93 86.34,22.95 87.71,21.58 87.71,15.24 87,14.53 83.31,14.53 83.06,14.78 R7.2
LIGHTVCC: length 85.5
  电源层 w0.254: CN3.A9 CN3.B9 3.75,25.98 1.56,23.79 v1(1.56,23.71)
  Bottom Layer w0.508: 8.3,10.34 3.3,10.34 1.78,11.86 1.78,15.48 CN3.B18 1.75,15.86 0.58,17.03 0.58,22.73 v1(1.56,23.71) ; 8.3,10.34 8.25,10.39 CN3.A18 ; 8.3,10.34 28.57,10.34 32.46,14.22 32.46,17.74 32.17,18.04 32.17,26.21 33.01,27.06 40.21,27.06 43.05,29.9 44.12,29.9 v1(44.9,30.67) v1(44.9,32.4)
LIN1: length 27.3
  Top Layer w0.152: 66.4,30.25 66.42,30.27 66.42,30.91 66.53,31.02 69.64,31.02 71.12,29.54 71.12,23.61 73.34,21.39 77.26,21.39 79.54,19.1 82.68,19.1 83.25,19.67 U2.29
LIN2: length 27.5
  Top Layer w0.152: 65.9,30.25 65.91,30.26 65.91,31.04 66.23,31.36 69.91,31.36 71.37,29.9 71.37,23.72 73.45,21.64 77.36,21.64 79.65,19.35 82.3,19.36 82.75,19.81 U2.28
LIN3: length 27.9
  Top Layer w0.152: 65.4,30.25 65.4,31.29 65.91,31.8 70.1,31.8 71.63,30.28 71.63,23.82 73.55,21.9 77.47,21.9 79.76,19.61 81.91,19.61 82.25,19.94 U2.27
LO1: length 28.5
  Top Layer w0.254: v1(67.68,9.47) 68.08,9.87 Q6.4 ; 63.15,27.5 v1(60.71,27.5)
  Bottom Layer w0.254: v1(67.68,9.47) 67.31,9.83 61.21,9.83 60.71,10.34 60.71,17.7 59.94,18.47 59.94,26.73 v1(60.71,27.5)
LO2: length 25.7
  Top Layer w0.254: 63.15,28 62.13,28 v1(61.98,28.15) ; v1(62.74,9.2) 62.82,9.2 Q4.4
  Bottom Layer w0.254: v1(61.98,28.15) 60.22,28.15 59.44,27.36 59.44,18.09 60.2,17.32 60.2,9.96 60.96,9.2 v1(62.74,9.2)
LO3: length 26
  Top Layer w0.254: 63.15,28.5 62.48,28.5 62.1,28.88 v1(60.71,28.88) ; Q2.4 57.87,9.79 v1(57.66,9.58)
  Bottom Layer w0.254: v1(57.66,9.58) 59.06,9.58 59.69,10.21 59.69,16.82 58.93,17.58 58.93,27.86 59.94,28.88 v1(60.71,28.88)
ME3121_FB: length 13.4
  Top Layer w0.254: v1(51.94,24.18) 51.94,24.93 U7.3 ; C35.1 58.16,31.49 R16.1 58.16,29.36 57.92,29.12 57.52,29.12 57.37,28.97 57.37,28.46 57.15,28.25 R18.2 v1(55.75,28.25)
  Bottom Layer w0.254: v1(51.94,24.18) 54.61,24.18 55.16,24.73 55.16,27.66 v1(55.75,28.25)
ME3121_FB2: length 13
  Top Layer w0.254: v1(42.42,28.12) 43.32,28.12 R10.2 R2.1 43.44,31.49 C44.1 ; U12.3 v1(46.91,24.18)
  Bottom Layer w0.254: v1(42.42,28.12) 42.42,27.61 42.54,27.48 45.97,27.48 46.23,27.23 46.23,24.86 v1(46.91,24.18)
MOTOR_U: length 4.6
  Top Layer w0.254: v1(68.55,4.5) 69.31,3.73 72.51,3.73 U1.2
  vias: v1(67.69,6.91) v1(67.69,6.08) v1(67.72,5.26) v1(67.69,4.5) v1(68.52,6.91) v1(68.52,6.06) v1(68.54,5.26)
MOTOR_V: length 4.6
  Top Layer w0.254: v1(65.01,3.84) 65.02,3.82 65.02,2.34 65.35,2.01 U6.2
  vias: v1(64.26,6.53) v1(64.26,5.64) v1(64.26,4.75) v1(65,6.53) v1(65,5.65) v1(65.02,4.75) v1(65.79,6.53) v1(65.79,5.64) v1(65.79,4.75)
MOTOR_W: length 5.2
  Top Layer w0.254: v1(61.47,4.5) 59.44,4.5 58.04,3.1 57.25,3.1 U5.2
  vias: v1(61.47,6.91) v1(61.48,6.06) v1(61.47,5.26) v1(62.31,6.91) v1(62.36,6.02) v1(62.36,5.26) v1(62.36,4.5)
NRST: length 5.1
  Top Layer w0.254: U2.7 83.75,30.22 83.57,30.4 83.19,30.4 82.93,30.66 82.93,31.17 82.74,31.36 C10.2 80.44,31.36 R1.1
OSC_IN: length 9.1
  Top Layer w0.254: U2.5 84.75,30.19 85.34,30.79 C32.1 85.34,31.82 85.6,32.08 85.91,32.08 86.07,32.24 86.07,33.29 86.36,33.58 86.54,33.58 86.74,33.78 86.74,35.87 86.37,36.23 X1.1
OSC_OUT: length 7.3
  Top Layer w0.254: X1.3 83.44,34.4 83.44,33.71 83.62,33.53 84.31,33.53 84.46,33.38 84.46,32.27 84.26,32.08 83.84,32.08 83.69,31.93 C31.2 84.21,31.36 84.46,31.11 84.46,30.56 84.25,30.35 U2.6
PD0: length 16.9
  Top Layer w0.127: U17.81 16.5,15.58 v2(16.49,15.57)
  电源层 w0.127: CN3.A10 8.25,23.41 11.18,20.48 11.18,18.47 14.31,15.33 16.26,15.33 v2(16.49,15.57)
PD1: length 18
  Top Layer w0.127: U17.82 17.02,17.44 v2(17.02,16.31)
  电源层 w0.127: v2(17.02,16.31) 17.02,15.42 16.76,15.16 16.75,15.16 16.69,15.1 14.21,15.1 10.95,18.37 10.95,20.39 7.92,23.42 7.34,23.42 CN3.A11
PD2: length 14.9
  Top Layer w0.127: v2(17.51,15.56) 17.5,15.57 U17.83
  电源层 w0.127: v2(17.51,15.56) 17.51,15.27 17.11,14.88 14.12,14.88 10.72,18.28 10.72,19.18 8.39,21.51 CN3.A12
PD3: length 17.3
  Top Layer w0.127: v2(18.03,16.31) 18.03,17.43 U17.84
  电源层 w0.127: v2(18.03,16.31) 18.03,15.04 17.64,14.65 14.02,14.65 10.49,18.18 10.49,19.07 9.05,20.51 CN3.A13
PD4: length 15.1
  Top Layer w0.127: v2(18.54,15.55) 18.54,17.42 U17.85
  电源层 w0.127: v2(18.54,15.55) 18.54,15.04 17.92,14.42 13.93,14.42 8.84,19.51 CN3.A14
PD5: length 17.4
  Top Layer w0.127: v2(19.05,16.31) 19.05,17.41 U17.86
  电源层 w0.127: CN3.A15 9.51,18.51 13.83,14.19 18.2,14.19 19.05,15.04 v2(19.05,16.31)
PD6: length 15.7
  Top Layer w0.127: v2(19.56,15.55) 19.56,17.4 U17.87
  电源层 w0.127: v2(19.56,15.55) 19.56,15.04 18.48,13.96 13.74,13.96 10.33,17.36 8.4,17.36 CN3.A16
PD7: length 17.8
  Top Layer w0.127: v2(20.07,16.31) 20,16.37 U17.88
  电源层 w0.127: CN3.A17 10.87,16.51 13.64,13.73 18.58,13.73 20.07,15.22 v2(20.07,16.31)
PD8: length 12.5
  Top Layer w0.127: v1(10.63,29.01) 10.63,29.01 U17.55
  Bottom Layer w0.127: v1(10.63,29.01) 10.12,28.5 7.86,28.5 7.27,27.91 7.27,27.9 6.98,27.61 6.73,27.61 6.66,27.53 3.22,27.53 2.61,26.91 2.61,26.37 CN3.B10
PD9: length 10.4
  Top Layer w0.127: v1(10.69,28.25) 11.18,28.25 11.44,28.51 U17.56
  Bottom Layer w0.127: CN3.B11 3.88,24.51 4.91,25.53 6.81,25.53 7.81,26.53 8.98,26.53 v1(10.69,28.25)
PD10: length 17.9
  Top Layer w0.127: 9.43,26.3 10.86,27.72 10.91,27.72 11.19,28.01 U17.57
  Bottom Layer w0.127: CN3.B12 1.75,20.91 3.17,19.48 3.34,19.48 3.34,19.49 6.66,19.49 6.66,19.48 6.86,19.48 7.24,19.86 7.24,23.12 9.43,25.31 9.43,26.3
  vias: v1(9.48,26.26)
PD11: length 14.6
  Top Layer w0.127: CN3.B13 4.78,19.48 5.84,19.48 5.84,19.49 6.66,19.49 6.66,19.48 6.86,19.48 7.24,19.86 7.24,23.12 10.08,25.96 10.08,26.39 11.2,27.51 U17.58
PD12: length 19.6
  Top Layer w0.127: U17.59 11.21,27.01 10.31,26.11 10.31,25.45 v1(8.84,23.98)
  Bottom Layer w0.127: CN3.B14 1.75,19.13 3.34,17.53 6.66,17.53 6.7,17.58 6.73,17.58 7.62,18.47 7.82,18.47 7.84,18.49 8.78,18.49 9.23,18.93 9.23,21.91 8.83,22.32 8.83,23.99
PD13: length 16.1
  Top Layer w0.127: CN3.B15 3.77,18.51 4.74,17.53 6.69,17.53 7.64,18.49 8.78,18.49 9.4,19.1 9.4,24.18 10.54,25.33 10.54,25.89 11.16,26.51 U17.60
PD14: length 20.6
  Top Layer w0.127: v1(10.04,24.05) 10.78,24.78 10.78,25.8 10.98,26.01 U17.61
  Bottom Layer w0.127: CN3.B16 2.56,16.7 2.56,16.16 3.3,15.42 6.73,15.42 7.84,16.53 8.86,16.53 9.53,17.2 9.53,23.53 v1(10.04,24.05)
PD15: length 17.2
  Top Layer w0.127: U17.62 11.23,25.51 11,25.28 11,24.26 9.78,23.04 9.78,17.45 8.86,16.53 7.87,16.53 6.76,15.42 4.84,15.42 CN3.B17
PE0: length 52.7
  Top Layer w0.127: U17.97 24.5,16.42 v1(24.26,16.18)
  电源层 w0.127: v1(24.26,16.18) 24.26,15.93 24.89,15.29 28.96,15.29 31.09,17.43 31.1,31.74 24.96,37.88 12.64,37.88 9.27,34.51 CN3.A1
PE1: length 49.1
  Top Layer w0.127: U17.98 25,16.2 v1(25.02,16.18)
  电源层 w0.127: CN3.A2 9.36,33.51 13.5,37.65 24.86,37.65 30.87,31.64 30.86,17.52 29.01,15.67 25.53,15.67 v1(25.02,16.18)
PE2: length 44
  Top Layer w0.127: U17.1 v3(28.83,19.01)
  电源层 w0.127: v3(28.83,19.01) 29.75,19.01 30.64,19.9 ; CN3.A3 9.46,32.51 9.82,32.87 9.82,32.88 14.35,37.42 24.76,37.42 30.63,31.55 30.63,19.9
PE3: length 41.8
  Top Layer w0.127: v3(29.45,19.52) 27.56,19.52 U17.2
  电源层 w0.127: CN3.A4 9.55,31.51 10.05,32.01 10.05,32.79 14.45,37.19 24.67,37.19 30.41,31.45 30.41,20.1 29.83,19.52 v3(29.45,19.52)
PE4: length 43.6
  Top Layer w0.127: U17.3 28.79,20.01 v3(28.83,20.04)
  电源层 w0.127: CN3.A5 9.65,30.51 10.28,31.14 10.28,32.69 14.54,36.96 24.57,36.96 30.18,31.36 30.18,20.32 29.9,20.04 v3(28.83,20.04)
PE5: length 41.2
  Top Layer w0.127: v3(29.46,20.51) U17.4
  电源层 w0.127: CN3.A6 9.74,29.51 10.51,30.27 10.51,32.6 14.64,36.73 24.48,36.73 29.95,31.26 29.95,21 v3(29.46,20.51)
PE6: length 42.3
  Top Layer w0.127: U17.5 v3(28.83,21.01)
  电源层 w0.127: CN3.A7 9.07,28.51 10.74,30.18 10.74,32.5 14.73,36.5 24.38,36.5 29.72,31.17 29.72,21.64 29.09,21.01 v3(28.83,21.01)
PE7: length 19.9
  Top Layer w0.127: v1(19.35,35.97) 20,35.32 U17.38
  电源层 w0.127: CN3.A8 8.39,27.51 10.96,30.08 10.96,32.41 14.83,36.27 19.05,36.27 v1(19.35,35.97)
PE8: length 19.3
  Top Layer w0.127: U17.39 19.5,35.03 18.54,35.99 5.14,35.99 3.75,34.61 CN3.B1
PE9: length 21.6
  Top Layer w0.127: U17.40 19,35.03 18.26,35.77 5.63,35.77 4.74,34.88 4.74,33.74 4.5,33.51 CN3.B2
PE10: length 19.2
  Top Layer w0.127: CN3.B3 3.84,32.51 5.08,33.75 5.08,34.79 5.83,35.54 17.86,35.54 18.5,34.89 U17.41
PE11: length 20.7
  Top Layer w0.127: CN3.B4 4.33,31.51 4.95,32.14 4.95,32.94 5.5,33.49 6.77,33.49 8.59,35.31 17.45,35.31 18,34.76 U17.42
PE12: length 18
  Top Layer w0.127: CN3.B5 3.86,30.51 4.84,31.49 6.84,31.49 7.84,32.49 9.51,32.49 12.1,35.08 17.17,35.08 17.5,34.75 U17.43
PE13: length 20.1
  Top Layer w0.127: U17.44 17,34.61 16.76,34.85 12.19,34.85 9.65,32.31 9.65,31.42 8.76,30.53 7.65,30.53 6.66,29.53 6.62,29.53 6.6,29.51 CN3.B6
PE14: length 19.7
  Top Layer w0.127: CN3.B7 4.73,27.53 6.91,27.53 6.91,27.55 7.84,28.49 7.86,28.49 7.87,28.5 9.14,28.5 9.88,29.24 9.88,32.21 12.29,34.62 16.13,34.62 16.5,34.25 U17.45
PE15: length 23.4
  Top Layer w0.127: CN3.B8 1.78,27.48 3.34,27.48 3.34,27.49 4.16,27.49 4.16,27.48 4.19,27.48 4.95,26.72 4.95,25.96 5.38,25.53 6.81,25.53 7.81,26.53 9.02,26.53 10.11,27.62 10.11,32.12 12.38,34.39 15.57,34.39 16,33.96 U17.46
RX: length 145.1
  Top Layer w0.127: v1(86.86,23.98) 87.17,23.98 87.41,24.22 88.21,24.22 U2.41 ; U17.68 11.11,22.51 v1(10.92,22.7)
  Bottom Layer w0.127: v1(10.92,22.7) 10.14,21.92 10.14,17.16 10.13,17.15 10.13,14.25 12.54,11.84 27.65,11.84 30.89,15.07 30.89,27.44 31.59,28.14 39.58,28.14 40.54,29.1 40.54,40.53 42.32,42.32 53.31,42.32 57.75,37.87 71.53,37.87 76.1,42.44 80.03,42.44 80.57,42.98 87.54,42.98 91,39.52 91,24.5 90.68,24.18 87.06,24.18 v1(86.86,23.98)
SBLYLOSC_IN: length 16.8
  Top Layer w0.254: X2.1 36.44,31.82 36.19,32.06 33.02,32.06 32.77,31.8 C50.1 32.19,31.23 31.88,31.55 31.5,31.55 30.86,30.91 30.86,25.45 29.92,24.51 U17.12
SBLYLOSC_OUT: length 13.8
  Top Layer w0.254: U17.13 29.53,25.01 30.35,25.83 30.35,31.42 31.81,32.88 C49.2 34.41,32.88 X2.3
SBLYLSWDCLK: length 13.1
  Top Layer w0.254: U17.76 13.97,17.43 13.97,13.51 15.49,11.99 20.07,11.99 20.62,11.44 U3.3
SBLYLSWDIO: length 19.3
  Top Layer w0.254: v1(20.83,13.89) 21.87,12.85 U3.4 ; U17.72 14.97,20.51 v1(14.99,20.5)
  电源层 w0.254: v1(14.99,20.5) 20.45,20.5 20.83,20.12 v1(20.83,13.89)
SBLYLVCC: length 171.4
  Top Layer w0.254: U17.19 25.38,28.01 25.02,28.37 25.02,29.01 ; v1(29.34,35.99) 29.39,36.04 29.39,37.46 29.21,37.64 13.04,37.64 SW2.2 ; U17.11 26.5,24.01 26.12,23.64 v1(26.12,21.51) ; 26,18.72 25.27,18.72 25.08,18.91 25.08,21.32 25.27,21.51 v1(26.12,21.51) ; 26,18.72 26.31,18.72 26.69,18.34 28.83,18.34 29.02,18.15 C40.2 ; 26,18.72 U17.100 ; 25.48,29.01 25.48,29.01 25.02,29.01 ; 25.48,29.01 25.05,29.01 25.02,29.04 25.02,29.55 ; 25.48,29.01 U17.21 ; v1(26.12,21.51) 27.55,21.51 U17.6 ; 25.02,29.01 14.61,29.01 14,29.61 U17.50 ; U17.75 11.21,19.01 11.05,18.85 11.05,17.51 C12.2 ; C47.2 25.53,35.1 25.02,34.6 25.02,32.58 U17.28 25.02,32.54 25.02,29.55 ; U17.22 25.06,29.51 25.02,29.55
  Top Layer w0.508: U15.5 62.87,37.99 63.04,37.81 63.04,35.16 62.74,34.85 C52.2 C51.2 62.04,32.37 61.85,32.18 59.82,32.18 59.31,32.69 59.31,35.1 58.48,35.93 v1(54.74,35.93) ; C40.2 v1(31.75,17.45) ; 29.26,35.92 29.16,35.92 28.64,35.4 C47.2 ; v1(11.05,15.04) 10.99,15.1 C12.2
  电源层 w0.508: v1(11.05,15.04) 13.21,12.88 30.61,12.88 31.75,14.02 v1(31.75,17.45) 31.75,26.34 32.89,27.48 38.61,27.48 39.88,28.75 39.88,36.25 ; 39.88,36.25 29.59,36.25 v1(29.34,35.99) ; 39.88,36.25 41.15,36.25 41.91,35.48 54.29,35.48 v1(54.74,35.93)
SPI_CLK: length 13.8
  Top Layer w0.254: v1(78.51,27.05) 78.51,27.53 78.74,27.76 U2.13
  Bottom Layer w0.254: U8.7 74.38,23.38 78.05,27.05 v1(78.51,27.05)
SPI_CSN: length 14
  Top Layer w0.254: v1(78.71,26.23) 79.72,26.23 U2.16
  Bottom Layer w0.254: U8.8 76.66,22.73 78.71,24.78 v1(78.71,26.23)
SPI_MISO: length 16.5
  Top Layer w0.254: U2.14 81,27.26 v1(81.15,27.1)
  Bottom Layer w0.254: U8.5 73.91,24.68 77.47,28.25 80.01,28.25 v1(81.15,27.1)
SPI_MOSI: length 16.9
  Top Layer w0.254: v1(81.15,26.21) 80.61,26.76 U2.15
  Bottom Layer w0.254: v1(81.15,26.21) 79.63,27.74 77.85,27.74 74.15,24.03 U8.6
SWDCLK: length 63.3
  Top Layer w0.254: v1(54.67,44.88) 55.25,44.88 55.42,44.7 55.42,44.32 56.35,43.39 U13.3 ; U2.38 89.43,22.76 89.8,23.13 89.8,38.71 85.14,43.37 v1(78.9,43.37)
  Bottom Layer w0.254: v1(54.67,44.88) 54.23,44.45 54.23,43.16 58.47,38.92 70.43,38.92 74.87,43.37 v1(78.9,43.37)
SWDIO: length 62.4
  Top Layer w0.254: v1(54.81,44.12) 54.74,44.05 54.74,43.23 55.22,42.75 U13.4 ; U2.37 89.63,22.26 90.3,22.92 90.3,38.91 85.02,44.19 v1(79.15,44.19)
  Bottom Layer w0.254: v1(54.81,44.12) 54.81,43.28 58.67,39.42 70.23,39.42 75,44.19 v1(79.15,44.19)
TX: length 145
  Top Layer w0.127: U17.69 12.44,22.02 11.23,22.02 v1(10.93,21.72) ; U2.40 87.46,23.76 v1(86.87,23.17)
  Bottom Layer w0.127: v1(86.87,23.17) 87.5,23.8 90.93,23.8 91.23,24.1 91.23,39.61 87.63,43.21 80.48,43.21 79.94,42.67 76,42.67 71.44,38.1 57.85,38.1 53.4,42.55 42.23,42.55 40.31,40.63 40.31,29.2 39.48,28.37 31.5,28.37 30.66,27.53 30.66,15.16 27.56,12.07 12.64,12.07 10.36,14.35 10.36,17.06 10.36,17.06 10.36,21.15 v1(10.93,21.72)
UART3_RX: length 31.1
  Top Layer w0.152: CN1.2 73.5,42.44 72.14,41.07 72.14,24.03 73.76,22.4 77.72,22.4 79.25,20.88 79.76,20.88 80.65,21.77 81.15,21.77 81.25,21.67 U2.25
UART3_TX: length 27.3
  Top Layer w0.152: U2.22 78.2,23.26 77.6,22.66 73.87,22.66 72.39,24.14 72.39,39.68 74.63,41.92 CN1.1
VSENSE: length 8.4
  Top Layer w0.254: U2.12 81.25,28.34 81.15,28.25 77.97,28.25 R9.2 77.74,27.82 C21.2 76.26,26.34 R8.1
$1N8: length 12.2
  Top Layer w0.254: 65.4,26.25 65.41,26.24 v1(65.41,25.32) ; v1(67.31,15.55) 67.14,15.38 Q3.4
  Bottom Layer w0.254: v1(67.31,15.55) 67.31,20.17 65.41,22.08 v1(65.41,25.32)
$1N18: length 22.9
  Top Layer w0.254: 64.9,30.27 64.9,31.42 64.64,31.67 60.71,31.67 59.18,30.15 59.18,21.77 60.2,20.75 D2.1 60.03,19.8 C1.2 57.97,19.8 R5.1
$1N19: length 3.6
  Top Layer w0.254: C4.1 62.8,24.37 63.17,24.74 64.12,24.74 64.47,25.08 64.47,25.65 64.4,25.71 U4.14
$1N20: length 2.5
  Top Layer w0.254: C42.1 65.99,24.07 65.99,25.57 65.88,25.67 65.88,26.25 U4.17
$1N24: length 4.6
  Top Layer w0.254: C43.1 68.9,24.37 67.94,25.32 67.94,27.23 67.65,27.52 U4.20
$1N203: length 7
  Top Layer w0.254: U2.10 82.25,30.2 82.04,30.4 78.99,30.4 78.74,30.66 C24.1 78.69,31.3 R4.1
$1N260: length 1.6
  Top Layer w0.254: C19.2 67.5,36.75 U10.4
$1N283: length 1.6
  Top Layer w0.254: C25.2 63.97,36.73 U11.4
$1N298: length 10.8
  Top Layer w0.254: R13.1 74.68,28 v1(74.68,28.75) 74.68,29.58 C23.2 ; U2.11 81.75,27.78 v1(81.79,27.74)
  Bottom Layer w0.254: v1(81.79,27.74) 80.77,28.75 v1(74.68,28.75)
$1N301: length 12.1
  Top Layer w0.254: C41.1 75.44,30.53 75.56,30.4 77.47,30.4 77.72,30.15 77.72,29.65 R14.1 77.84,29.52 v1(78.87,29.52) ; U2.9 v1(82.75,27.74)
  Bottom Layer w0.254: v1(82.75,27.74) 82.75,28.71 81.51,29.95 79.3,29.95 v1(78.87,29.52)
$1N316: length 1.7
  Top Layer w0.127: R6.1 81.31,17.03 LED3.1
$1N318: length 6.5
  Top Layer w0.127: R7.1 83.06,17.58 82.8,17.83 78.23,17.83 77.97,17.57 LED4.1
$1N354: length 12.2
  Top Layer w0.127: U2.45 86.47,26.26 86.2,25.99 86.19,25.99 85.88,25.67 85.88,22.76 87.25,21.39 87.25,18.72 86.4,17.87 R12.1
$1N357: length 12.2
  Top Layer w0.254: v1(63.88,25.32) 63.9,25.34 63.9,26.25 ; Q1.4 62.32,15.38 v1(62.48,15.55)
  Bottom Layer w0.254: v1(63.88,25.32) 63.88,22.4 62.48,21.01 v1(62.48,15.55)
$1N358: length 2.5
  Top Layer w0.254: R3.1 68.96,27.86 68.83,27.99 67.18,27.99 U4.21
$1N363: length 16.2
  Top Layer w0.254: U4.19 67.18,26.99 67.18,25.12 v1(66.75,24.69) ; v1(72.39,15.55) 72.22,15.38 Q5.4
  Bottom Layer w0.254: v1(66.75,24.69) 66.75,22.45 67.88,21.32 70.29,21.32 72.39,19.23 v1(72.39,15.55)
$2N86: length 6.4
  Top Layer w0.254: R17.1 27.31,15.55 23.37,15.55 23,15.91 U17.94
$2N89: length 10.2
  Top Layer w0.254: R19.1 28.58,32.43 29.59,31.42 29.59,25.83 29.27,25.51 U17.14
$2N108: length 1.6
  Top Layer w0.254: 60.64,36.5 60.39,36.75 U15.4
$2N113: length 23.2
  Top Layer w0.127: v1(11.43,37.64) 12.32,36.75 R20.2
  Bottom Layer w0.127: v1(11.43,37.64) 11.43,34.47 12.41,33.49 U14.31
$2N118: length 1.5
  Top Layer w0.127: R20.1 31.63,36.75 LED1.2
$2N119: length 1.5
  Top Layer w0.127: LED2.2 31.63,38.41 R23.1
$2N121: length 28.3
  Top Layer w0.127: SW2.1 11.47,43.61 v1(12.83,43.61) 12.83,38.66 13.08,38.41 R23.2
  Bottom Layer w0.127: U14.34 12.95,38.54 12.95,43.49 v1(12.83,43.61)

## Copper pours and planes (outline as drawn; the poured copper is in the pictures)
+5V on Top Layer: 55.63,32.8 57.4,32.8 57.4,29.33 56.98,28.91 55.85,28.91 55.63,29.13
+5V on Top Layer: 52.07,33.58 52.07,34.85 52.32,35.1 56.01,35.1 56.26,35.36 57.02,35.36 57.15,35.23 57.15,29.52 57.02,29.39 56.39,29.39 56.26,29.52 56.26,33.33 56.13,33.45 52.2,33.45
+5V on 电源层: 55.85,28.91 55.63,29.13 55.63,39.52 59.18,43.1 69.63,43.1 69.84,42.89 69.84,41.69 69.53,41.38 59.93,41.31 57.4,38.79 57.4,29.33 56.98,28.91
GND on Top Layer: -8.13,62.15 112.65,62.15 112.65,-4.9 -8.13,-4.9
GND on Top Layer: 67.21,10.23 67.21,12.73 68.94,12.73 68.94,10.23
GND on Top Layer: 62.23,10.26 62.23,12.76 63.96,12.76 63.96,10.26
GND on Top Layer: 57.16,10.13 57.16,12.63 58.88,12.63 58.88,10.13
GND on Bottom Layer: -11.94,65.08 116.46,65.08 116.46,-7.31 -11.94,-7.31
GND on 地层: 0.26,45.44 99.74,45.44 99.74,5.09 0.26,5.09
GND on 地层: 23.7,21.42 35.89,21.42 35.89,8.77 23.7,8.77
GND on 地层: 38.78,12.17 40.89,12.17 40.89,8.77 38.78,8.77
GND on 地层: 3.5,21.53 4,21.53 4,15.49 3.5,15.49
GND on 地层: 66.32,29.09 83.31,29.09 83.31,24.14 66.32,24.14
GND on 地层: 78.23,27.59 78.99,27.59 78.99,25.68 78.23,25.68
GND on 地层: 61.04,7.34 68.98,7.34 68.98,3.28 61.04,3.28
GND on 地层: 16.2,16.81 20.35,16.81 20.35,15.04 16.2,15.04
GND on 地层: 48.4,26.52 48.88,26.52 48.88,24.38 48.4,24.38
GND on 地层: 10.25,29.57 11.07,29.57 11.07,27.69 10.25,27.69
GND on 地层: 62.1,16.11 62.87,16.11 62.87,14.17 62.1,14.17
GND on 地层: 1.5,35.53 9.96,35.53 9.96,15.49 1.5,15.49
GND on 地层: 66.33,43.28 67.02,43.28 67.02,41.27 66.33,41.27
GND on 地层: 45.29,27.35 45.89,27.35 45.89,25.27 45.29,25.27
GND on 电源层: -10.41,63.68 114.94,63.68 114.94,-5.92 -10.41,-5.92
PVCC on Top Layer: 53.97,26.34 55.67,26.34 56.32,26.99 57.13,26.99 57.13,24.54 57.02,24.44 54.23,24.44 53.97,24.69
PVCC on Top Layer: 45.95,27.1 45.95,24.28 45.85,24.18 44.32,24.18 44.2,24.31 44.2,26.98 44.32,27.1
PVCC on Top Layer: 38.07,18.72 38.32,19.32 38.32,21.49 55.31,21.49 55.45,21.35 55.45,19.28 55.88,18.85 55.25,18.21 54.23,18.21 53.47,18.72
PVCC on Top Layer: 38,19.01 72,19.01 72,16.51 38,16.51
PVCC on Top Layer: 37.97,16.94 44.45,16.94 44.45,10.47 41.78,7.8 38.74,7.8 37.97,8.56
PVCC on Top Layer: 58.04,16.31 57.53,16.82 57.53,17.2 71.25,17.2 71.25,16.43 70.68,15.87 70.68,13.2 70.61,13.13 68.33,13.13 68.2,13.26 68.2,16.31 67.96,16.55 66.02,16.54 65.79,16.31 65.79,13.26 65.66,13.13 63.25,13.13 63.12,13.26 63.12,16.43 62.99,16.56 60.83,16.56 60.71,16.43 60.71,13.26 60.58,13.13 58.17,13.13 58.04,13.26
PVCC on Top Layer: 48.26,26.31 50.32,26.31 50.42,26.21 50.42,24.56 50.29,24.44 48.39,24.44 48.26,24.56
PVCC on 电源层: 48.35,21.39 53.21,21.39 53.31,21.48 53.31,23.91 52.91,24.31 42.67,24.31 42.55,24.43 42.55,27.25 42.65,27.36 57.28,27.36 57.4,27.23 57.4,24.54 57.04,24.18 55.75,24.18 55.51,23.93 55.51,19.22 55.11,18.82 48.59,18.82 48.35,19.06
I_SENSE_U on Top Layer: 69.34,10.21 72.03,10.21 72.17,10.07 72.17,6.06 71.94,5.83 70.8,5.83 70.23,6.4 70.23,7.8 69.4,8.63 69.4,10.02 69.34,10.08
I_SENSE_U on Top Layer: 72.14,14.78 72.14,13.28 72.01,11.99 72.01,9.7 71.88,9.58 69.47,9.58 69.34,9.7 69.34,11.99 69.47,12.12 70.26,12.12 71.28,13.43 71.25,14.87 71.29,14.91 72.01,14.91
I_SENSE_V on Top Layer: 65.33,12.02 66.04,13.11 66.07,14.68 66.42,15.04 67.06,15.04 67.18,14.91 67.18,13.26 67.06,13.13 67.06,9.7 66.04,8.69 66.04,7.42 65.91,7.29 64.13,7.29 63.92,7.5 63.92,9.24 64.45,9.76 64.45,12.02
I_SENSE_W on Top Layer: 59.31,9.83 61.98,9.83 61.98,9.2 61.85,9.07 61.47,9.07 60.07,7.67 60.07,6.01 59.89,5.83 58.03,5.83 57.76,6.1 57.76,8.03 57.91,8.18 58.38,8.18 59.31,9.11 59.31,9.83
I_SENSE_W on Top Layer: 61.02,14.71 61.34,15.04 61.85,15.04 61.98,14.91 61.98,9.58 61.85,9.45 59.44,9.45 59.31,9.58 59.31,11.86 59.44,11.99 60.2,11.99 61.01,12.82
LIGHTVCC on Top Layer: 49.28,33.45 45.85,33.45 45.59,33.2 45.59,29.52 45.34,29.26 44.58,29.26 44.32,29.52 44.32,35.23 44.45,35.36 45.34,35.36 45.59,35.1 49.28,35.1 49.4,34.98 49.4,33.58
MOTOR_U on Top Layer: 66.93,4.12 66.93,7.67 67.25,7.99 69.05,7.99 69.6,7.44 69.6,4.5 68.83,3.73 67.31,3.73
MOTOR_V on Top Layer: 64.66,3.46 63.91,4.22 63.91,6.9 65.91,6.91 66.08,6.9 66.08,4.22 65.32,3.46
MOTOR_W on Top Layer: 61.21,8.18 62.87,8.18 63.25,7.8 63.25,4.12 62.87,3.73 60.96,3.73 60.58,4.12 60.58,7.54
$1N245 on Top Layer: 51.3,26.58 51.3,27.21 51.93,27.85 51.93,28.86 52.06,28.99 52.82,28.99 52.92,28.89 52.92,27.77 52.57,27.42 52.57,26.7 52.44,26.58
$1N246 on Top Layer: 53.94,26.49 53.94,27.76 53.82,27.89 53.44,27.89 53.46,27.92 53.46,29.23 52.35,29.23 52.04,29.54 52.04,30.81 52.17,30.94 54.33,30.94 54.48,30.78 54.48,27.91 55.21,27.17 55.21,26.62 55.09,26.49
$1N336 on Top Layer: 34.16,20.88 35.81,20.88 36.7,19.99 36.7,8.43 35.94,7.67 34.04,7.67 32.94,8.77 32.94,19.65
$2N76 on Top Layer: 46.35,26.59 46.35,27.23 46.99,27.86 46.99,28.88 47.12,29.01 47.88,29.01 47.98,28.91 47.98,27.79 47.62,27.43 47.62,26.72 47.5,26.59
$2N77 on Top Layer: 49.02,26.47 49.02,27.74 48.9,27.86 48.51,27.86 48.54,27.89 48.54,29.21 47.42,29.21 47.12,29.52 47.12,30.79 47.24,30.91 49.4,30.91 49.56,30.76 49.56,27.88 50.29,27.15 50.29,26.59 50.16,26.47

Small or netless copper shapes (teardrops, artwork), in the pictures only: 59 on 地层
